# Altium schematic sheet adc_dac_rxd6.SchDoc: mcHF QRP Transceiver RF board
size A4; Author: K Atanassov; CompanyName: M0NKA; Revision: 0.6.3; SheetTotal: 12
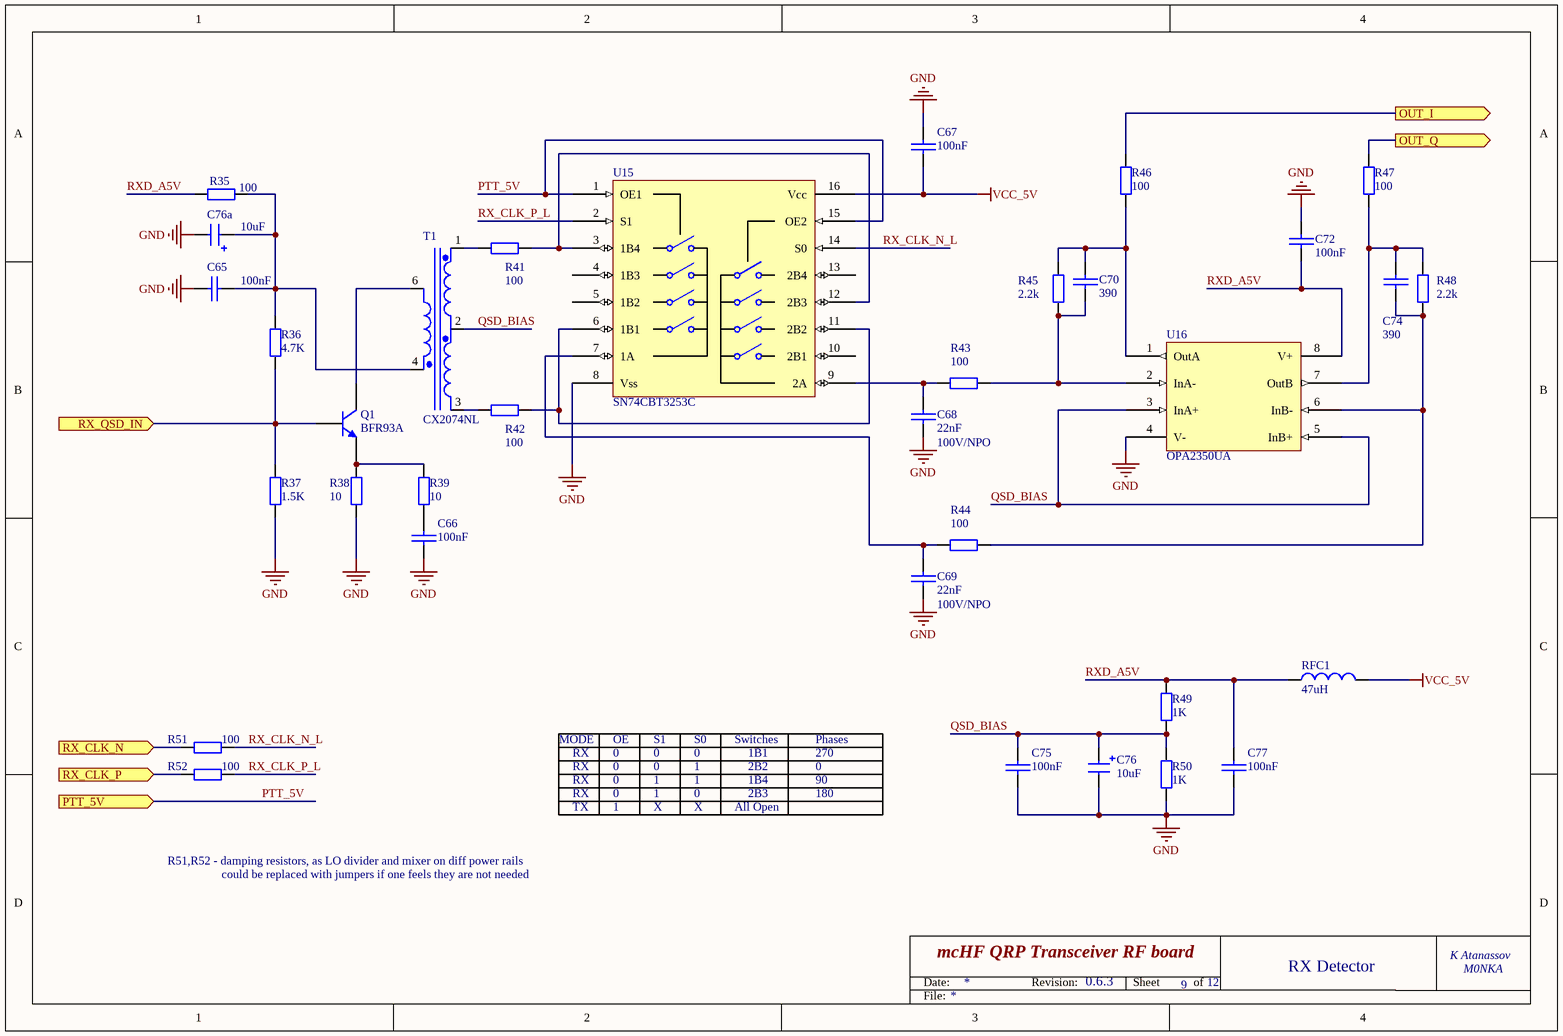
[diagram p0: adc_dac_rxd6.SchDoc]

## Parts
C65  100nF  [0805-Pro]
C66  100nF  [0805-Pro]
C67  100nF  [0805-Pro]
C68  22nF  Voltage: 100V/NPO  [CAP_B]
C69  22nF  Voltage: 100V/NPO  [CAP_B]
C70  390  [0805-Pro]
C72  100nF  [0805-Pro]
C74  390  [0805-Pro]
C75  100nF  [0805-Pro]
C76  10uF  [1206_Elec_Cap_N]
C76a  10uF  [1206_Elec_Cap_N]
C77  100nF  [0805-Pro]
Q1  BFR93A  [SOT-23-Pro]
R35  100  [0805-Pro]
R36  4.7K  [0805-Pro]
R37  1.5K  [0805-Pro]
R38  10  [0805-Pro]
R39  10  [0805-Pro]
R41  100  [0805-Pro]
R42  100  [0805-Pro]
R43  100  [0805-Pro]
R44  100  [0805-Pro]
R45  2.2k  [0805-Pro]
R46  100  [0805-Pro]
R47  100  [0805-Pro]
R48  2.2k  [0805-Pro]
R49  1K  [0805-Pro]
R50  1K  [0805-Pro]
R51  100  [0805-Pro]
R52  100  [0805-Pro]
RFC1  47uH  [0805-Pro]
T1  CX2074NL  [SOP5_NEW1]
U15  SN74CBT3253C  [SO-16-Pro]
U16  OPA2350UA  [SO-8-Pro]

## Ports
OUT_I (out), OUT_Q (out), PTT_5V (in), RX_CLK_N (in), RX_CLK_P (in), RX_QSD_IN (in)

## Nets
GND: C65.2 C66.1 C67.2 C68.2 C69.2 C72.1 C75.1 C76.2 C76a.2 C77.1 R37.2 R38.1 R50.1 U15.8(Vss) U16.4(V-)
VCC_5V: C67.1 RFC1.2 U15.16(Vcc)
OUT_I: R46.2 ; port OUT_I
OUT_Q: R47.2 ; port OUT_Q
PTT_5V: U15.1(OE1) U15.15(OE2) ; port PTT_5V
QSD_BIAS: C75.2 C76.1 R49.1 R50.2 T1.2(SecCmn) U16.3(InA+) U16.5(InB+)
RX_CLK_N: R51.2 ; port RX_CLK_N
RX_CLK_N_L: R51.1 U15.14(S0)
RX_CLK_P: R52.2 ; port RX_CLK_P
RX_CLK_P_L: R52.1 U15.2(S1)
RX_QSD_IN: Q1.1(B) R36.2 R37.1 ; port RX_QSD_IN
RXD_A5V: C72.2 C77.2 R35.1 R49.2 RFC1.1 U16.8(V+)
NetC65_1: C65.1 C76a.1 R35.2 R36.1 T1.4(Pri-)
NetC66_2: C66.2 R39.1
NetC68_1: C68.1 R43.1 U15.9(2A)
NetC69_1: C69.1 R44.1 U15.7(1A)
NetC70_1: C70.1 R43.2 R45.1 U16.2(InA-)
NetC70_2: C70.2 R45.2 R46.1 U16.1(OutA)
NetC74_1: C74.1 R44.2 R48.1 U16.6(InB-)
NetC74_2: C74.2 R47.1 R48.2 U16.7(OutB)
NetQ1_2: Q1.2(E) R38.2 R39.2
NetQ1_3: Q1.3(C) T1.6(Pri+)
NetR41_1: R41.1 T1.1(Sec0)
NetR41_2: R41.2 U15.3(1B4) U15.12(2B3)
NetR42_1: R42.1 T1.3(Sec180)
NetR42_2: R42.2 U15.6(1B1) U15.11(2B2)

Not connected (* = marked no-connect by the designer): U15 4(1B3) 5(1B2) 10(2B1) 13(2B4)

## Notes on the sheet
- MODE
- RX
- 0
- OE
- S1
- 1
- S0
- Switches
- 1B1
- 2B2
- 1B4
- Phases
- 270
- 90
- TX
- X
- All Open
- 2B3
- 180
- R51,R52 - damping resistors, as LO divider and mixer on diff power rails
- could be replaced with jumpers if one feels they are not needed
- 6
- RX Detector
- Date:
- Revision:
- Sheet
- of
- File:

## Library data of the parts
C65-C67 C72 C75 C77 = CAP: Capacitor; Order: FN 252-2090; QT Order: QCC-00154; Price: 0.068
C68 C69 = CAP: Capacitor; Order: FN 221-1120; Price: 0.84
C70 C74 = CAP: Capacitor; Order: FN 233-2701; QT Order: QCC-00125; Price: 0.078
C76 C76a = CAP-POL: Electrolitic capacitor; Order: FN 233-3009; QT Order: QCC-00166; Price: 0.204
Q1 = BFR93A: TRANSISTOR, RF, NPN, 12V, 0.035MA,SOT-23; Order: FN 108-1300; Price: 0.161
R35 R41-R44 R46 R47 R51 R52 = RES: Resistor; Order: FN 933-2375; QT Order: QCR-00301; Price: 0.027
R36 = RES: Resistor; Order: FN 200-8383; QT Order: QCR-00341; Price: 0.024
R37 = RES: Resistor; Order: FN 165-2940; QT Order: QCR-00329; Price: 0.036
R38 R39 = RES: Resistor; Order: FN 933-2421; QT Order: QCR-00279; Price: 0.013
R45 R48 = RES: Resistor; Order: FN 188-7289; QT Order: QCR-00333; Price: 0.046
R49 R50 = RES: Resistor; Order: FN 157-6459; QT Order: QCR-00326; Price: 0.061
RFC1 = TDK-NLV25T: INDUCTOR, SIGNAL LINE, 4.7UH, 1005; Order: FN 166-9895; Price: 0.166
T1 = CX2074NL: Wideband RF Transformer 1:4; Order: DK 553-1655-ND; Price: 2.01
U15 = SN74CBT3253C: Dual 4:1 Demux/Analog Switch; Order: FN 175-0447; Price: 0.69
U16 = OPA2350UA: High Speed, Single Supply OpAmp; Order: FN 110-1542; Price: 4.67